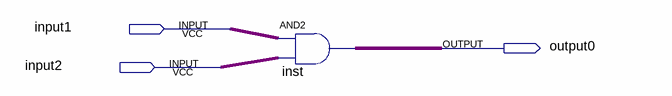
[diagram p0: schematic sheet]
// Quartus schematic and2Halka.bdf as structural Verilog: 1 symbols, 3 pins
module and2Halka (
  input  input1,
  input  input2,
  output output0
);

  and inst (output0, input1, input2);
endmodule
